# Altium schematic sheet Current Sense Amplifier.SchDoc
size 406 x 304 mm; SheetNumber: 4; SheetTotal: 10
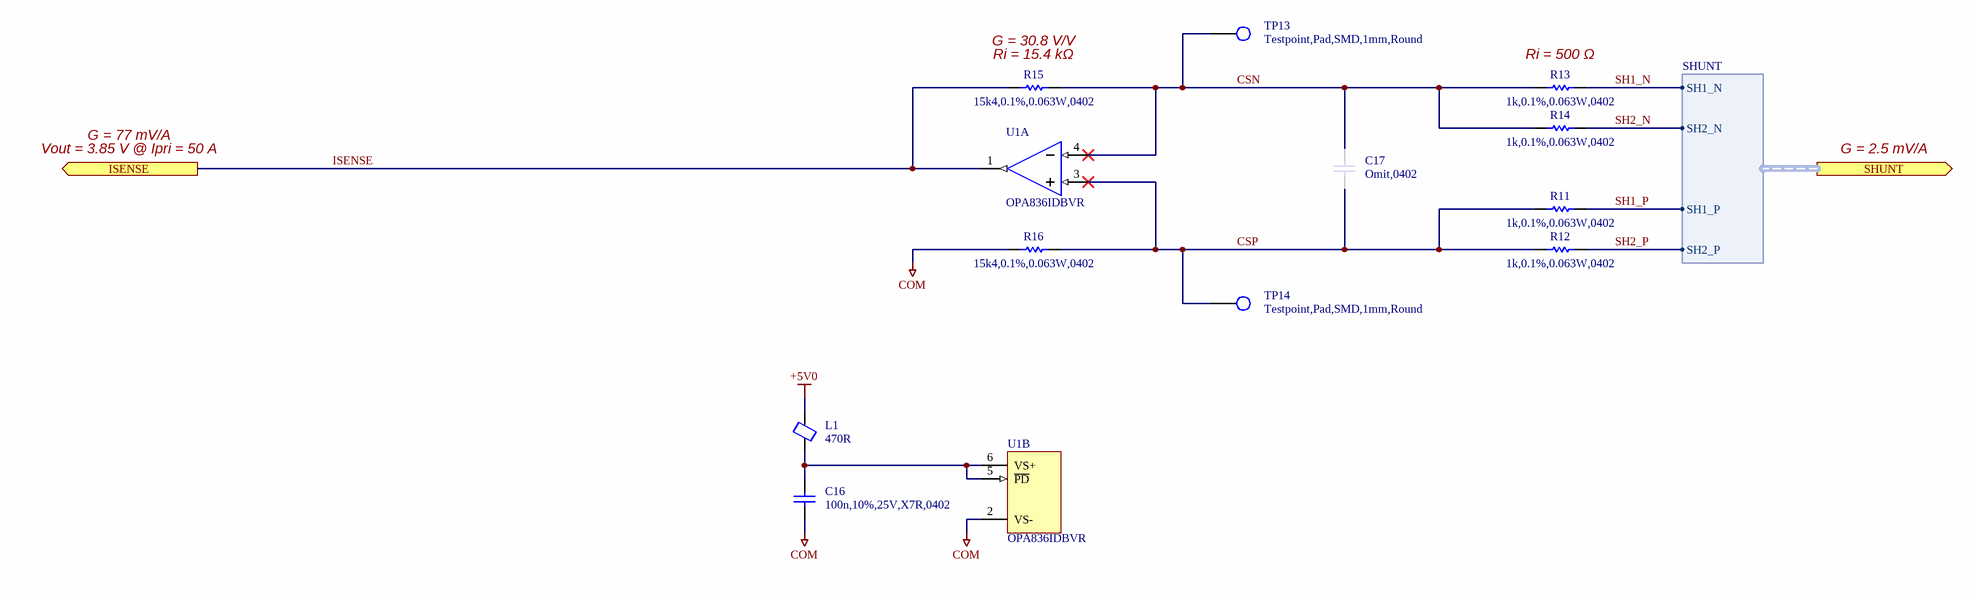
[diagram p0: Current Sense Amplifier.SchDoc]

## Parts
C16  100n,10%,25V,X7R,0402  [CAPC1005X06N]
C17  Omit,0402  [CAPC1005X06N]  (no BOM)
L1  470R  [INDC1005X05N]
R11  1k,0.1%,0.063W,0402  [RESC1005X04N]
R12  1k,0.1%,0.063W,0402  [RESC1005X04N]
R13  1k,0.1%,0.063W,0402  [RESC1005X04N]
R14  1k,0.1%,0.063W,0402  [RESC1005X04N]
R15  15k4,0.1%,0.063W,0402  [RESC1005X04N]
R16  15k4,0.1%,0.063W,0402  [RESC1005X04N]
TP13  Testpoint,Pad,SMD,1mm,Round  [TP100]
TP14  Testpoint,Pad,SMD,1mm,Round  [TP100]
U1  OPA836IDBVR  [TEXASINSTRUMENTS_PKG_DBV0006A]  (parts A,B of 2)

## Ports
ISENSE (out), SHUNT (out, harness SHUNT)

## Harnesses
SHUNT: SH1_P, SH1_N, SH2_P, SH2_N

## Nets
+5V0: L1.2
COM: C16.1 R16.1 U1.2(VS-)
CSN: C17.1 R13.1 R14.1 R15.2 TP13.1(TP) U1.4(VIN-)
CSP: C17.2 R11.1 R12.1 R16.2 TP14.1(TP) U1.3(VIN+)
ISENSE: R15.1 U1.1(VOUT) ; port ISENSE
SH1_N: R13.2 ; port SHUNT.SH1_N
SH1_P: R11.2 ; port SHUNT.SH1_P
SH2_N: R14.2 ; port SHUNT.SH2_N
SH2_P: R12.2 ; port SHUNT.SH2_P
NetC16_2: C16.2 L1.1 U1.5(~{PD}) U1.6(VS+)

## Notes on the sheet
- (near R15) G = 30.8 V/V
- (near R15) Ri = 15.4 kΩ
- (near R13) Ri = 500 Ω
- G = 77 mV/A
- Vout = 3.85 V @ Ipri = 50 A
- G = 2.5 mV/A
- Sheet Name:
- Date:
- Sheet
- Designer:
- of

## Library data of the parts
C16 = CAP,Cer,100nF,10%,25V,X7R,0402: 0.1ï¿½F ï¿½10% 25V Ceramic Capacitor X7R 0402 (1005 Metric); Manufacturer 1: Murata Electronics; Manufacturer 1 Part Number: GRM155R71E104KE14J; Vendor 1 Part Number: 490-14603-1-ND; Vendor 1: DigiKey; Value: 100nF; Part Name: CAP,Cer,100nF,10%,25V,X7R,0402; CreatedBy: Judd Foster; HelpURL: https://search.murata.co.jp/Ceramy/image/img/A01X/G101/ENG/GRM155R71E104KE14-01.pdf
C17 = CAP,Omit,0402: Omit; Part Name: CAP,Omit,0402; CreatedBy: Judd Foster; HelpURL: N/A; Manufacturer 1: N/A; Manufacturer 1 Part Number: N/A; Vendor 1: N/A; Vendor 1 Part Number: N/A; Value: Omit
L1 = Ferrite,470R@100MHz,0402: 470 Ohms @ 100 MHz 1 Power Line Ferrite Bead 0402 (1005 Metric) 1A 200mOhm; Manufacturer 1: Murata Electronics; Manufacturer 1 Part Number: BLM15PX471SN1D; Vendor 1 Part Number: 490-10662-1-ND; Vendor 1: Digikey; Part Name: Ferrite,470R@100MHz,0402; CreatedBy: Judd Foster; HelpURL: https://www.murata.com/en-us/products/productdata/8796740059166/ENFA0018.pdf; Value: 470R
R11-R14 = RES,1k,0.1%,0.063W,0402: 1 kOhms Â±0.1% 0.063W, 1/16W Chip Resistor 0402 (1005 Metric) Thin Film; Manufacturer 1: YAGEO; Manufacturer 1 Part Number: RT0402BRE071KL; Vendor 1 Part Number: YAG2306CT-ND; Vendor 1: DigiKey; Part Name: RES,1k,0.1%,0.063W,0402; CreatedBy: Judd Foster; HelpURL: https://www.yageo.com/upload/media/product/app/datasheet/rchip/pyu-rt_1-to-0.01_rohs_l.pdf; Value: 1k
R15 R16 = RES,15k4,0.1%,0.063W,0402: 15.4 kOhms Â±0.1% 0.063W, 1/16W Chip Resistor 0402 (1005 Metric) Thin Film; Manufacturer 1: YAGEO; Manufacturer 1 Part Number: RT0402BRD0715K4L; Vendor 1 Part Number: YAG4177CT-ND; Vendor 1: DigiKey; Part Name: RES,15k4,0.1%,0.063W,0402; CreatedBy: Judd Foster; HelpURL: https://www.yageo.com/upload/media/product/app/datasheet/rchip/pyu-rt_1-to-0.01_rohs_l.pdf; Value: 15k4
TP13 TP14 = Testpoint,Pad,SMD: PCB Testpoint 1mm Round; Part Name: Testpoint,Pad,SMD; CreatedBy: Judd Foster; HelpURL: N/A; Manufacturer 1: N/A; Manufacturer 1 Part Number: N/A; Vendor 1: N/A; Vendor 1 Part Number: N/A
U1 = OPA836IDBVR: Voltage Feedback Amplifier 1 Circuit Rail-to-Rail SOT-23-6; Manufacturer 1: Texas Instruments; Vendor 1 Part Number: 296-44388-1-ND; Vendor 1: DigiKey; Part Name: OPA836IDBVR; CreatedBy: Judd Foster; HelpURL: https://www.ti.com/lit/ds/symlink/opa836.pdf?HQS=dis-dk-null-digikeymode-dsf-pf-null-wwe&ts=1741112370606&ref_url=https%253A%252F%252Fwww.ti.com%252Fgeneral%252Fdocs%252Fsuppproductinfo.tsp%253FdistId%253D10%2526gotoUrl%253Dhttps%253A%252F%252Fwww.ti.com%; Manufacturer 1 Part Number: OPA836IDBVR